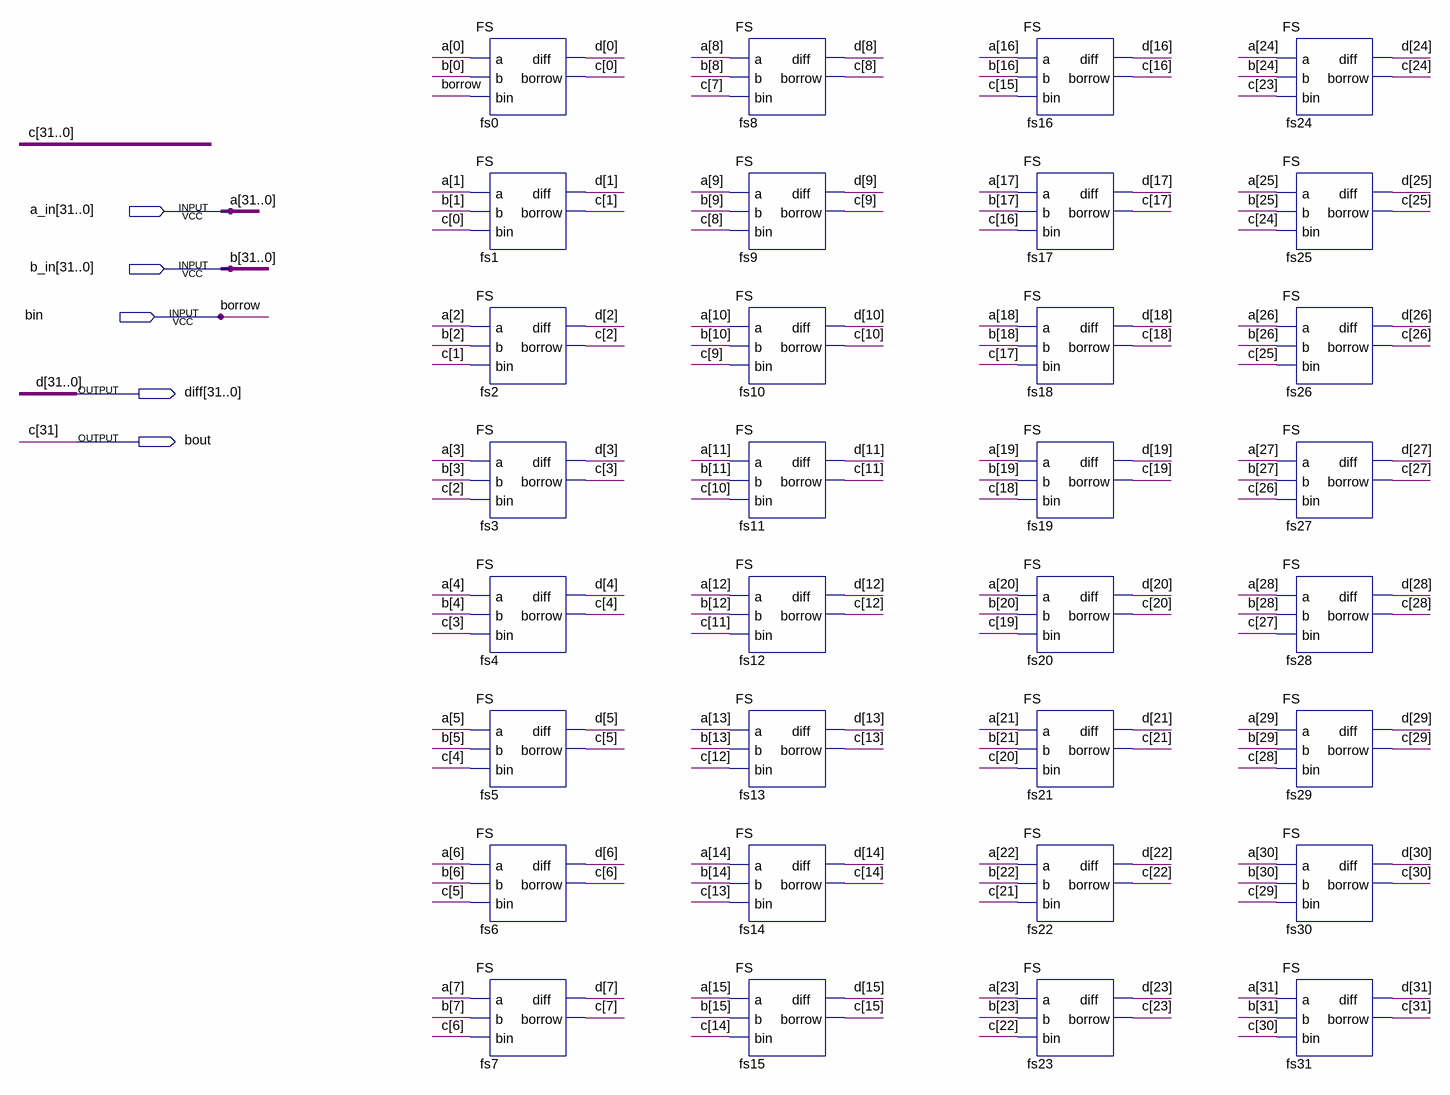
[diagram p0: schematic sheet]
// Quartus schematic Subtracter.bdf as structural Verilog: 32 symbols, 5 pins
module Subtracter (
  input  [31:0] a_in,
  input  [31:0] b_in,
  input  bin,
  output [31:0] diff,
  output bout
);

  wire [30:0] c;

  FS fs0 (.a(a_in[0]), .b(b_in[0]), .bin(bin), .diff(diff[0]), .borrow(c[0]));
  FS fs1 (.a(a_in[1]), .b(b_in[1]), .bin(c[0]), .diff(diff[1]), .borrow(c[1]));
  FS fs2 (.a(a_in[2]), .b(b_in[2]), .bin(c[1]), .diff(diff[2]), .borrow(c[2]));
  FS fs3 (.a(a_in[3]), .b(b_in[3]), .bin(c[2]), .diff(diff[3]), .borrow(c[3]));
  FS fs4 (.a(a_in[4]), .b(b_in[4]), .bin(c[3]), .diff(diff[4]), .borrow(c[4]));
  FS fs5 (.a(a_in[5]), .b(b_in[5]), .bin(c[4]), .diff(diff[5]), .borrow(c[5]));
  FS fs6 (.a(a_in[6]), .b(b_in[6]), .bin(c[5]), .diff(diff[6]), .borrow(c[6]));
  FS fs7 (.a(a_in[7]), .b(b_in[7]), .bin(c[6]), .diff(diff[7]), .borrow(c[7]));
  FS fs8 (.a(a_in[8]), .b(b_in[8]), .bin(c[7]), .diff(diff[8]), .borrow(c[8]));
  FS fs9 (.a(a_in[9]), .b(b_in[9]), .bin(c[8]), .diff(diff[9]), .borrow(c[9]));
  FS fs10 (.a(a_in[10]), .b(b_in[10]), .bin(c[9]), .diff(diff[10]), .borrow(c[10]));
  FS fs11 (.a(a_in[11]), .b(b_in[11]), .bin(c[10]), .diff(diff[11]), .borrow(c[11]));
  FS fs12 (.a(a_in[12]), .b(b_in[12]), .bin(c[11]), .diff(diff[12]), .borrow(c[12]));
  FS fs13 (.a(a_in[13]), .b(b_in[13]), .bin(c[12]), .diff(diff[13]), .borrow(c[13]));
  FS fs14 (.a(a_in[14]), .b(b_in[14]), .bin(c[13]), .diff(diff[14]), .borrow(c[14]));
  FS fs15 (.a(a_in[15]), .b(b_in[15]), .bin(c[14]), .diff(diff[15]), .borrow(c[15]));
  FS fs16 (.a(a_in[16]), .b(b_in[16]), .bin(c[15]), .diff(diff[16]), .borrow(c[16]));
  FS fs17 (.a(a_in[17]), .b(b_in[17]), .bin(c[16]), .diff(diff[17]), .borrow(c[17]));
  FS fs18 (.a(a_in[18]), .b(b_in[18]), .bin(c[17]), .diff(diff[18]), .borrow(c[18]));
  FS fs19 (.a(a_in[19]), .b(b_in[19]), .bin(c[18]), .diff(diff[19]), .borrow(c[19]));
  FS fs20 (.a(a_in[20]), .b(b_in[20]), .bin(c[19]), .diff(diff[20]), .borrow(c[20]));
  FS fs21 (.a(a_in[21]), .b(b_in[21]), .bin(c[20]), .diff(diff[21]), .borrow(c[21]));
  FS fs22 (.a(a_in[22]), .b(b_in[22]), .bin(c[21]), .diff(diff[22]), .borrow(c[22]));
  FS fs23 (.a(a_in[23]), .b(b_in[23]), .bin(c[22]), .diff(diff[23]), .borrow(c[23]));
  FS fs24 (.a(a_in[24]), .b(b_in[24]), .bin(c[23]), .diff(diff[24]), .borrow(c[24]));
  FS fs25 (.a(a_in[25]), .b(b_in[25]), .bin(c[24]), .diff(diff[25]), .borrow(c[25]));
  FS fs26 (.a(a_in[26]), .b(b_in[26]), .bin(c[25]), .diff(diff[26]), .borrow(c[26]));
  FS fs27 (.a(a_in[27]), .b(b_in[27]), .bin(c[26]), .diff(diff[27]), .borrow(c[27]));
  FS fs28 (.a(a_in[28]), .b(b_in[28]), .bin(c[27]), .diff(diff[28]), .borrow(c[28]));
  FS fs29 (.a(a_in[29]), .b(b_in[29]), .bin(c[28]), .diff(diff[29]), .borrow(c[29]));
  FS fs30 (.a(a_in[30]), .b(b_in[30]), .bin(c[29]), .diff(diff[30]), .borrow(c[30]));
  FS fs31 (.a(a_in[31]), .b(b_in[31]), .bin(c[30]), .diff(diff[31]), .borrow(bout));

  // Other names for the same wires on the sheet: a[31:0] = a_in; b[31:0] = b_in; borrow = bin; c[31] = bout;
  //   d[31:0] = diff
endmodule
